# EAGLE design desulphator (EAGLE 5.06)
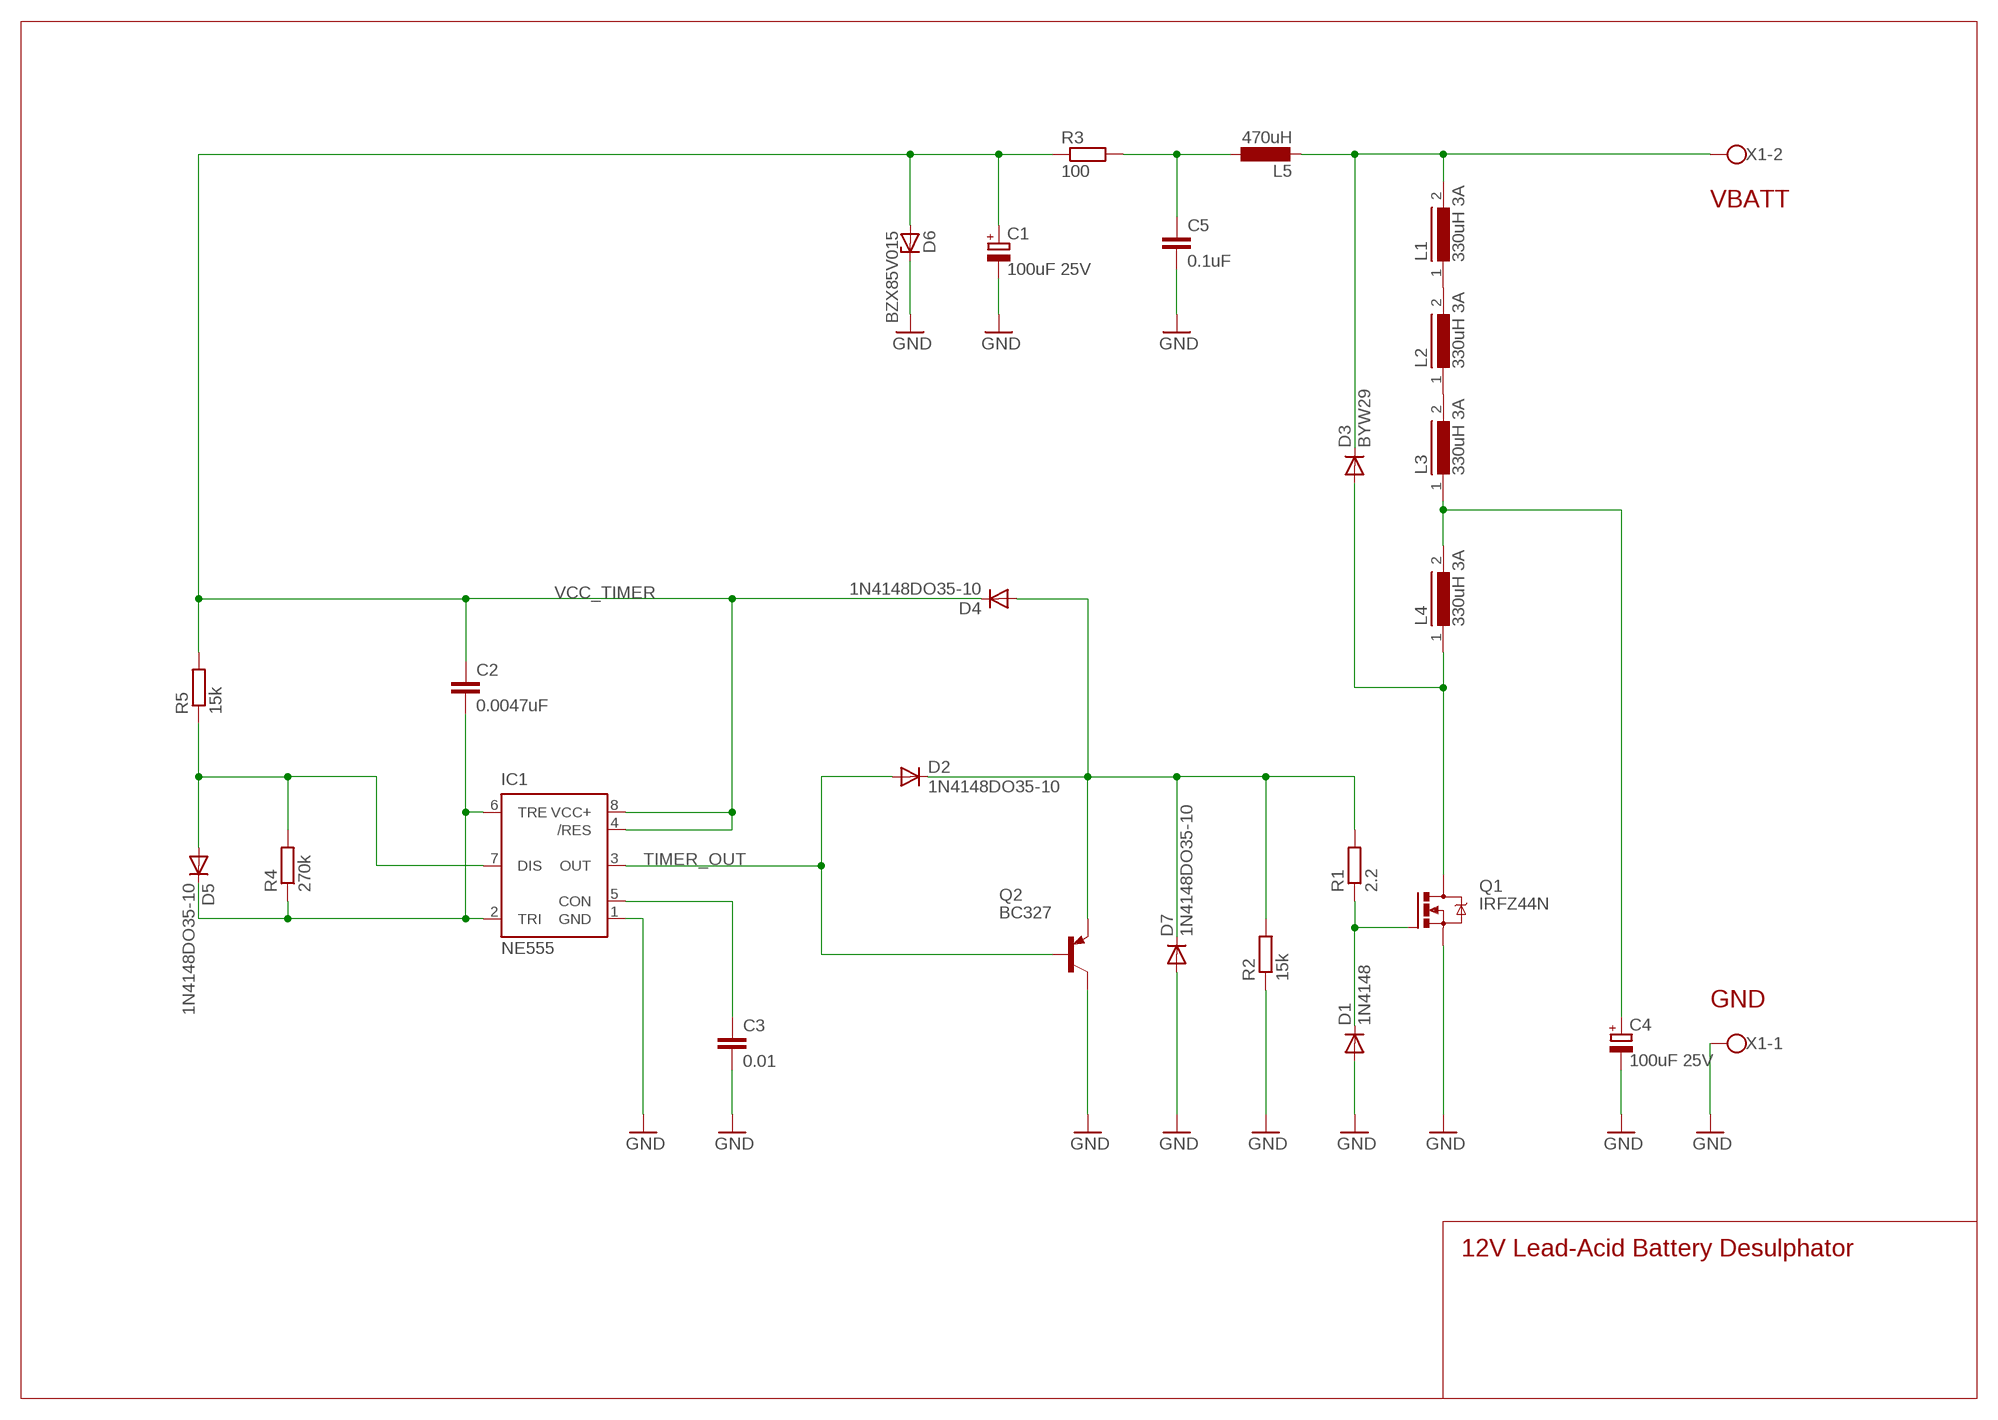
[diagram p0: schematic, sheet 1]

## Parts
C1  100uF 25V  CPOL-EUE2.5-6  [E2,5-6]
C2  0.0047uF  C-EU025-030X050  [C025-030X050]
C3  0.01  C-EU025-030X050  [C025-030X050]
C4  100uF 25V  CPOL-EUE2.5-6  [E2,5-6]
C5  0.1uF  C-EU025-030X050  [C025-030X050]
D1  1N4148  1N4148DO35-10  [DO35-10]
D2  1N4148DO35-10  [DO35-10]
D3  BYW29  [DO220S]
D4  1N4148DO35-10  [DO35-10]
D5  1N4148DO35-10  [DO35-10]
D6  BZX85V015  ZENER-DIODEP1-Z12  [P1Z12]
D7  1N4148DO35-10  [DO35-10]
IC1  NE555  [DIL-08]
L1  330uH 3A  SFT1030  [SFT1030]
L2  330uH 3A  SFT1030  [SFT1030]
L3  330uH 3A  SFT1030  [SFT1030]
L4  330uH 3A  SFT1030  [SFT1030]
L5  470uH  L-EU0207/12  [0207/12]
Q1  IRFZ44N  IRF740  [TO220BV]
Q2  BC327  [TO92-EBC]
R1  2.2  R-EU_0207/12  [0207/12]
R2  15k  R-EU_0207/12  [0207/12]
R3  100  R-EU_0207/12  [0207/12]
R4  270k  R-EU_0207/12  [0207/12]
R5  15k  R-EU_0207/12  [0207/12]
X1  W237-02P  [W237-132]

## Nets
GATE_DRIVE: D1.C Q1.G R1.1
GND: C1.- C3.2 C4.- C5.2 D1.A D6.C D7.A IC1.1(GND) Q1.S Q2.C R2.1 X1.1
N$1: L2.1 L3.2
N$2: C4.+ L3.1 L4.2
N$3: D3.A L4.1 Q1.D
N$4: L1.1 L2.2
N$8: C5.1 L5.1 R3.2
N$10: C3.1 IC1.5(CON)
N$12: D5.A IC1.7(DIS) R4.2 R5.1
N$14: C2.2 D5.C IC1.2(TRI) IC1.6(TRE) R4.1
TIMER_OUT: D2.A IC1.3(OUT) Q2.B
TR_OUT: D2.C D4.A D7.C Q2.E R1.2 R2.2
VBATT: D3.C L1.2 L5.2 X1.2
VCC_TIMER: C1.+ C2.1 D4.C D6.A IC1.4(/RES) IC1.8(VCC+) R3.1 R5.2

## Notes on the sheet
- 12V Lead-Acid Battery Desulphator

## Library data of the parts
C1 C4 = resistor:CPOL-EU: POLARIZED CAPACITOR, European symbol
C2 C3 C5 = rcl:C-EU: CAPACITOR, European symbol
D1 D2 D4 D5 D7 = diode:1N4148: DIODE high speed (Philips)
D3 = diode:BYW29: DIODE ultra fast rectifier, 200 V, 8 A
D6 = diode:ZENER-DIODE: Z-Diode
IC1 = st-microelectronics:NE555: General purpose bipolar Timer
L1-L4 = inductors:SFT1030: INDUCTOR
L5 = resistor:L-EU: INDUCTOR, European symbol
Q1 = transistor-power:IRF740: N-CHANNEL MOS FET
Q2 = transistor-pnp:BC327*: PNP Transistror
R1-R5 = resistor:R-EU_: RESISTOR, European symbol
X1 = con-wago-508:W237-02P: WAGO SREW CLAMP

## Net classes
1 thin: width 0.254 mm
2 z: width 0.127 mm

## Board
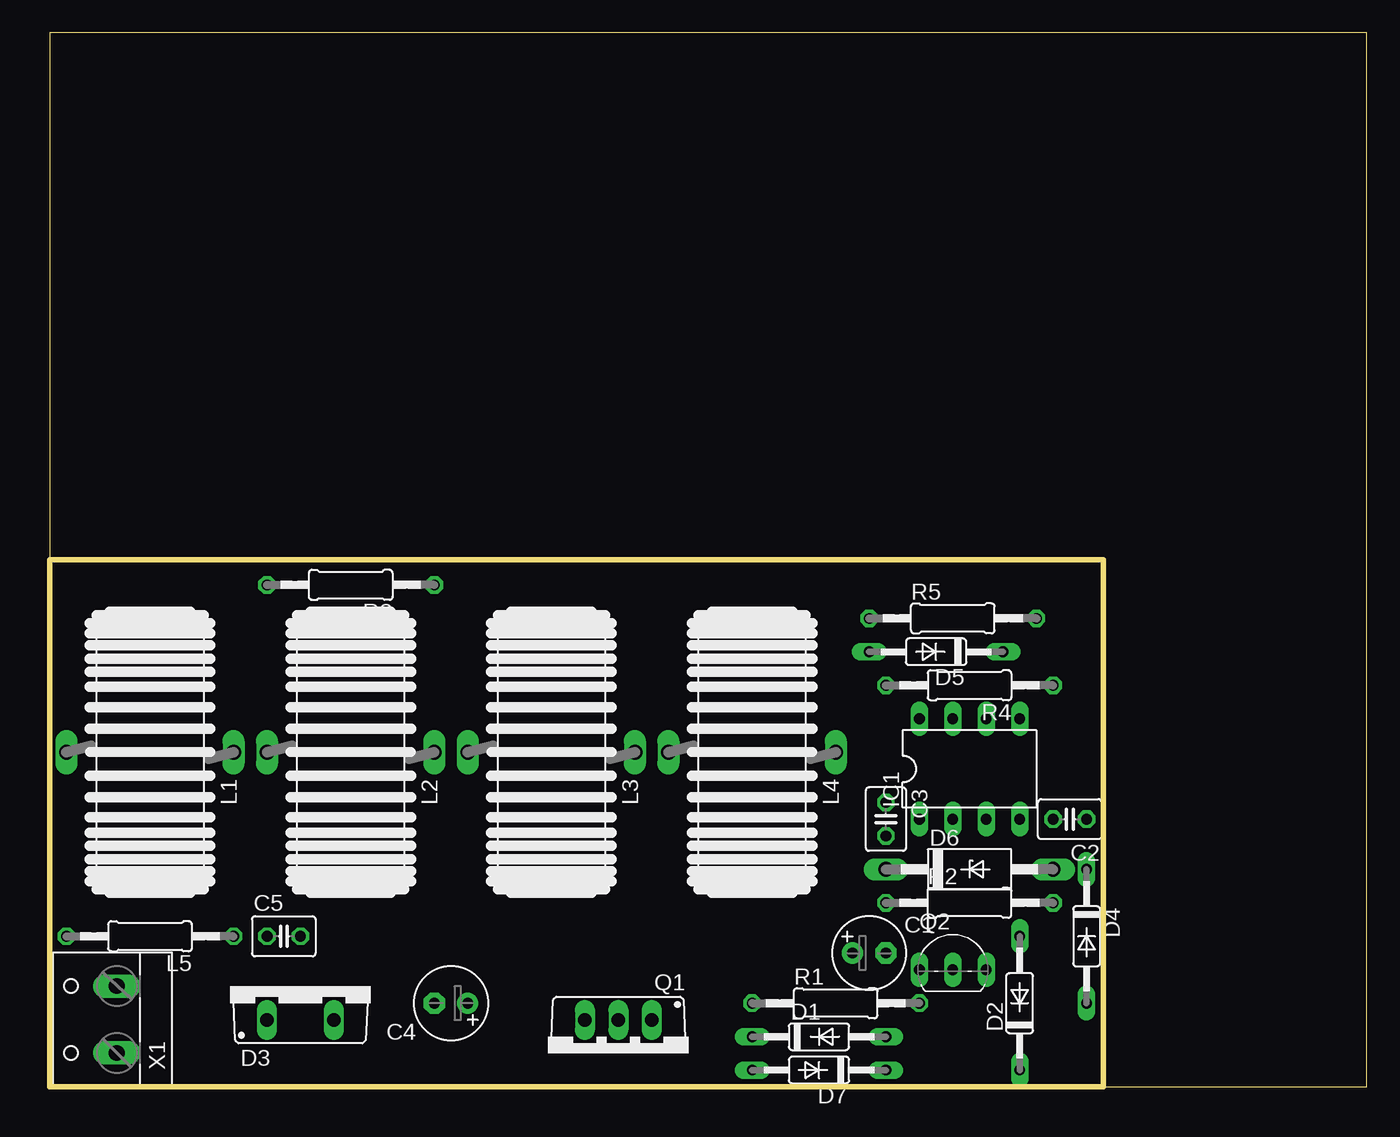
[diagram p1: board, top side]
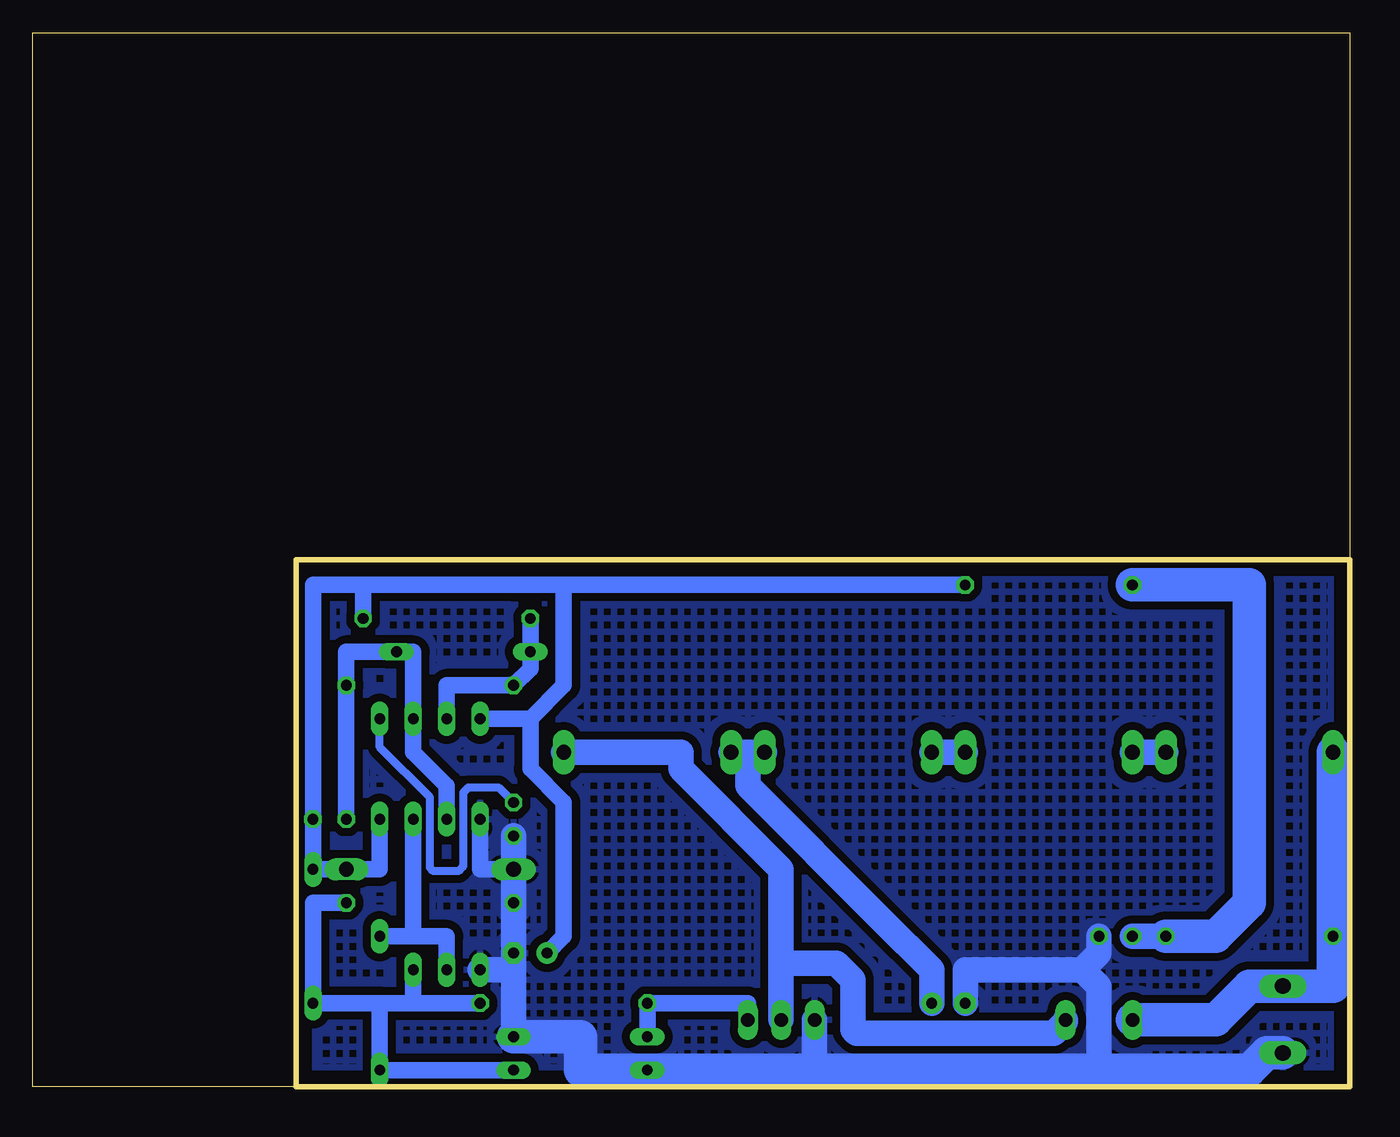
[diagram p2: board, bottom side, seen from below]

Size 100 x 80 mm. Coordinates in mm from the lower left corner, seen from the top.
Outline: 0,0 80,0
Outline: 80,0 100,0 100,80 0,80 0,0
Outline: 0,0 80,0
Outline: 80,0 80,40 0,40 0,0
Copper layers (1*16): Top 0.035mm / dielectric 1.5mm / Bottom 0.035mm
Design rules "default": minimum track width 10mil, minimum drill 24mil, track to track 8mil, track to pad 8mil, pad to pad 8mil, via to via 8mil, smd to smd 8mil, copper to edge 40mil, drill to drill 8mil, minimum pad ring 10mil, minimum via ring 8mil, stop-mask expansion 4mil, vias tented up to drill 0mil, thermal gap 10mil

### Footprints (pad centres in the part's own frame; a part is rotated, then mirrored left to right if it is on the bottom)
E2,5-6 = drill 0.813 pad 1.6 round: + -1.27,0 | drill 0.813 pad 1.6 octagon: - 1.27,0
C025-030X050 = drill 0.813 octagon: 1 -1.27,0; 2 1.27,0
DO35-10 = drill 0.813 long: A 5.08,0; C -5.08,0
DO220S = drill 1.016 long: A 2.54,-2.54; C -2.54,-2.54
P1Z12 = drill 1.118 long: A 6.35,0; C -6.35,0
DIL-08 = drill 0.813 long: 1 -3.81,-3.81; 2 -1.27,-3.81; 3 1.27,-3.81; 4 3.81,-3.81; 5 3.81,3.81; 6 1.27,3.81; 7 -1.27,3.81; 8 -3.81,3.81
SFT1030 = drill 1.118 long: 1 -6.35,0; 2 6.35,0
0207/12 = drill 0.813 octagon: 1 -6.35,0; 2 6.35,0
TO220BV = drill 1.016 long: D 0,-2.54; G -2.54,-2.54; S 2.54,-2.54
TO92-EBC = drill 0.813 long: B 0,-1.27; C -2.54,-1.27; E 2.54,-1.27
W237-132 = drill 1.194 long: 1 -2.54,-0.635; 2 2.54,-0.635

### Placement (x,y rotation side)
C1  62.23,10.16 0 top
C2  77.47,20.32 180 top
C3  63.5,20.32 270 top
C4  30.48,6.35 180 top
C5  17.78,11.43 0 top
D1  58.42,3.81 0 top
D2  73.66,6.35 90 top
D3  19.05,7.62 0 top
D4  78.74,11.43 270 top
D5  67.31,33.02 180 top
D6  69.85,16.51 0 top
D7  58.42,1.27 180 top
IC1  69.85,24.13 0 top
L1  7.62,25.4 180 top
L2  22.86,25.4 180 top
L3  38.1,25.4 180 top
L4  53.34,25.4 180 top
L5  7.62,11.43 180 top
Q1  43.18,2.54 180 top
Q2  68.58,10.16 0 top
R1  59.69,6.35 0 top
R2  69.85,13.97 0 top
R3  22.86,38.1 180 top
R4  69.85,30.48 180 top
R5  68.58,35.56 0 top
X1  4.46,5.11 90 top

### Tracks (layer width: path | path; a pad name or v marks a point on that pad's centre or on a via)
GATE_DRIVE
  Bottom 1.27: Q1.G 45.72,6.35 R1.1 D1.C
GND
  Bottom 1.27: IC1.1 66.04,16.51 D6.C
  Bottom 1.93: 19.05,1.27 19.05,7.62 20.32,8.89 | 20.32,8.89 29.21,8.89 C4.- | C5.2 19.05,10.16 20.32,8.89 | 40.64,1.27 Q1.S | 63.5,8.89 63.5,7.62 D1.A | 63.5,8.89 C1.- R2.1 D6.C C3.2 | 63.5,8.89 Q2.C
  Bottom 2.54: X1.1 6.32,2.57 7.62,1.27 19.05,1.27 40.64,1.27 D7.A 58.42,1.27 58.42,3.81 D1.A
  pour Bottom (isolate 0.61, hatched): 0,0 80.01,0 80.01,40.64 0,40.64
N$1
  Bottom 1.93: L2.1 L3.2
N$2
  Bottom 1.93: 45.72,25.4 L3.1 | 45.72,25.4 L4.2 | C4.+ 31.75,8.89 35.56,12.7 45.72,22.86 45.72,25.4
N$3
  Bottom 1.93: 43.18,9.91 43.18,6.35 Q1.D | 43.18,9.91 43.18,8.89 43.18,9.91 | L4.1 50.8,25.4 50.8,24.13 43.18,16.51 43.18,9.91 | D3.A 21.59,4.95 22.48,4.06 37.47,4.06 37.72,4.32 37.72,8.13 38.99,9.4 42.67,9.4 43.18,9.91
N$4
  Bottom 1.93: L1.1 L2.2
N$8
  Bottom 1.93: L5.1 C5.1
  Bottom 2.54: L5.1 10.16,11.43 7.62,13.97 7.62,38.1 R3.2
N$10
  Bottom 0.61: IC1.5 73.66,25.78 69.85,21.97 69.85,16.64 69.6,16.38 67.69,16.38 67.44,16.64 67.31,16.76 67.31,22.35 66.93,22.73 64.64,22.73 C3.1
N$12
  Bottom 1.27: IC1.7 68.58,30.48 R4.2 62.23,31.75 D5.A R5.1
N$14
  Bottom 1.27: IC1.2 68.58,22.86 71.12,25.4 IC1.6 71.12,33.02 D5.C 76.2,33.02 R4.1 C2.2
TIMER_OUT
  Bottom 1.27: 71.12,11.43 IC1.3 | 71.12,11.43 D2.A | 71.12,11.43 68.58,11.43 Q2.B
TR_OUT
  Bottom 1.27: 73.66,6.35 71.12,6.35 | 71.12,6.35 R1.2 71.12,6.35 | 73.66,6.35 D2.C D7.C | 73.66,6.35 71.12,6.35 | R2.2 78.74,13.97 D4.A 73.66,6.35 | 71.12,6.35 Q2.E
VBATT
  Bottom 2.54: D3.C 10.16,5.08 7.62,7.62 5.12,7.62 X1.2 1.3,7.65 1.27,7.62 L5.2 L1.2
VCC_TIMER
  Bottom 1.27: R3.1 59.69,38.1 | 59.69,38.1 62.23,38.1 63.5,38.1 74.93,38.1 | 74.93,38.1 78.74,38.1 78.74,19.05 | 78.74,19.05 C2.1 | C1.+ 59.69,11.43 59.69,21.59 62.23,24.13 62.23,27.94 | 62.23,27.94 59.69,30.48 59.69,38.1 | 62.23,27.94 IC1.8 | 74.93,38.1 R5.2 | IC1.4 73.66,16.51 D6.A D4.C 78.74,19.05